# Altium schematic sheet ver061_SignalAnalog.SchDoc
size A3; SheetNumber: 5; SheetTotal: 6
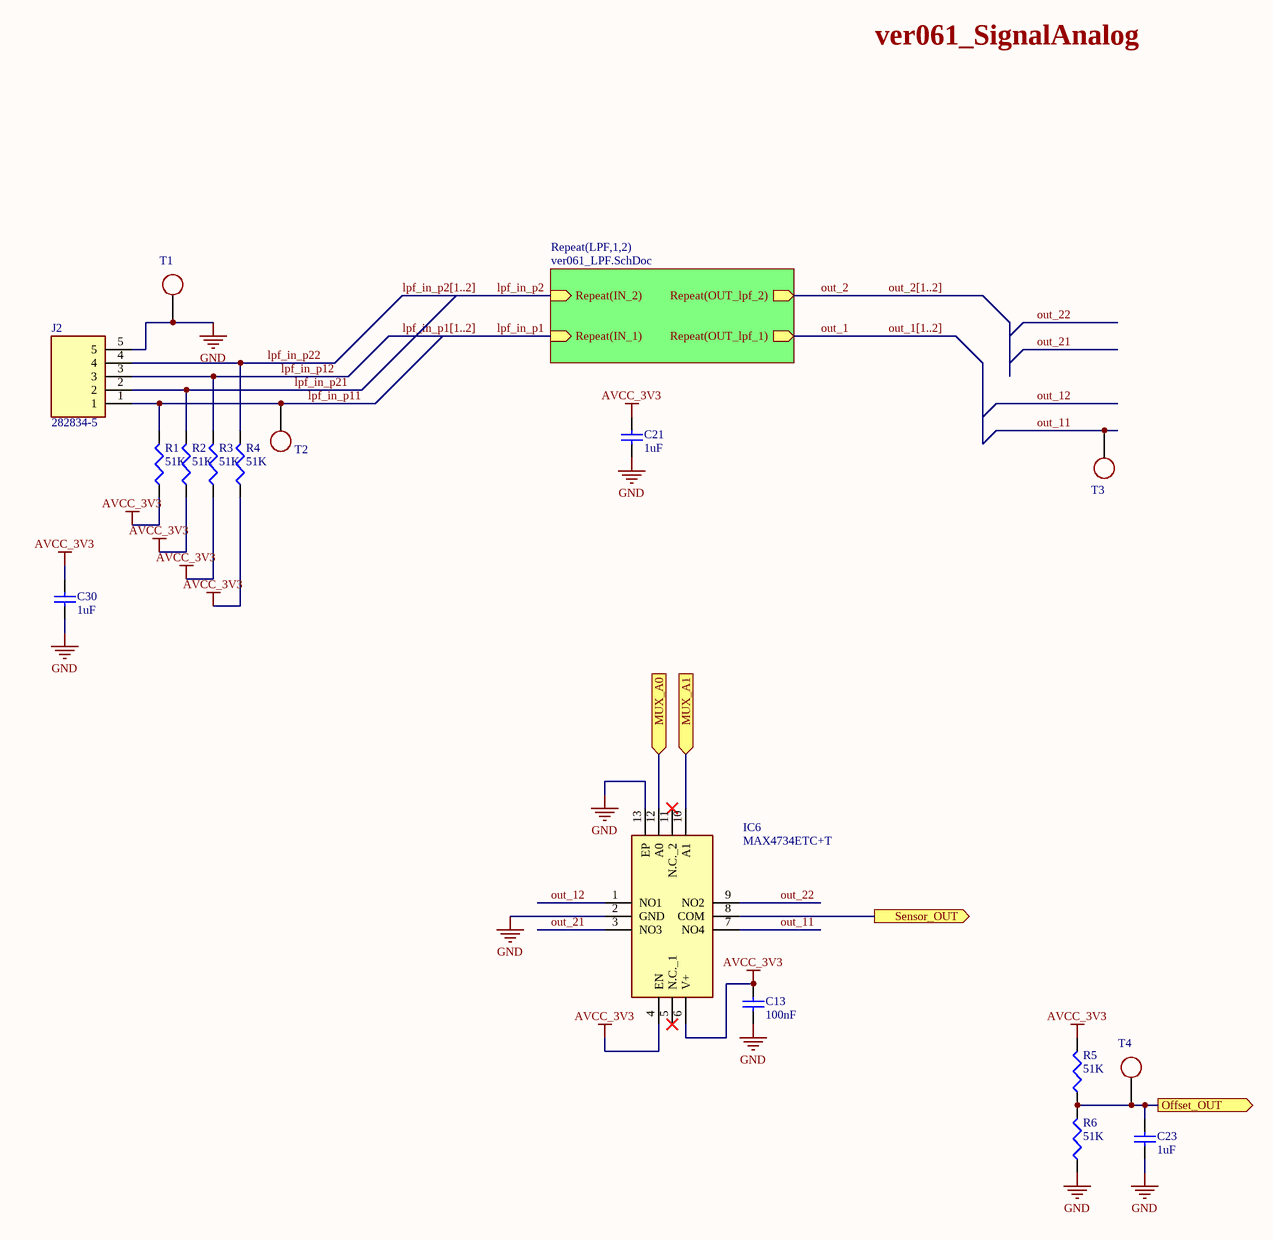
[diagram p0: ver061_SignalAnalog.SchDoc]

## Parts
C13  value 100nF  [1608[0603]]  (hidden comment: Cap Semi)
C21  value 1uF  [1608[0603]]  (hidden comment: Cap Semi)
C23  value 1uF  [0402]  (hidden comment: Cap Semi)
C30  value 1uF  [1608[0603]]  (hidden comment: Cap Semi)
IC6  MAX4734ETC+T  [QFN50P300X300X80-13N]
J2  282834-5  [2828345]
R1  value 51K  [RESC1608X55N]  (hidden comment: Res3)
R2  value 51K  [RESC1608X55N]  (hidden comment: Res3)
R3  value 51K  [RESC1608X55N]  (hidden comment: Res3)
R4  value 51K  [RESC1608X55N]  (hidden comment: Res3)
R5  value 51K  [RESC1005X35N]  (hidden comment: Res3)
R6  value 51K  [RESC1005X35N]  (hidden comment: Res3)
T1  TP_SMT  [TP_SMT_Round_0.6x0.6]  (value not drawn)
T2  TP_SMT  [TP_SMT_Round_0.6x0.6]  (value not drawn)
T3  TP_SMT  [TP_SMT_Round_0.6x0.6]  (value not drawn)
T4  TP_SMT  [TP_SMT_Round_0.6x0.6]  (value not drawn)

## Sub-sheets
Repeat(LPF,1,2) = ver061_LPF.SchDoc: Repeat(IN_1) (in), Repeat(IN_2) (in), Repeat(OUT_lpf_2) (out), Repeat(OUT_lpf_1) (out)

## Ports
MUX_A0 (in), MUX_A1 (in), Offset_OUT (out), Sensor_OUT (out)

## Nets
AVCC_3V3: C13.2 C21.2 C30.2 IC6.4(EN) IC6.6(V+) R1.1 R2.1 R3.1 R4.1 R5.2
GND: C13.1 C21.1 C23.1 C30.1 IC6.2(GND) IC6.13(EP) J2.5 R6.1 T1.1
lpf_in_p1: sheet Repeat(LPF,1,2)/Repeat(IN_1)
lpf_in_p2: sheet Repeat(LPF,1,2)/Repeat(IN_2)
lpf_in_p11: J2.1 R1.2 T2.1
lpf_in_p12: J2.3 R3.2
lpf_in_p21: J2.2 R2.2
lpf_in_p22: J2.4 R4.2
MUX_A0: IC6.12(A0) ; port MUX_A0
MUX_A1: IC6.10(A1) ; port MUX_A1
Offset_OUT: C23.2 R5.1 R6.2 T4.1 ; port Offset_OUT
out_1: sheet Repeat(LPF,1,2)/Repeat(OUT_lpf_1)
out_2: sheet Repeat(LPF,1,2)/Repeat(OUT_lpf_2)
out_11: IC6.7(NO4) T3.1
out_12: IC6.1(NO1)
out_21: IC6.3(NO3)
out_22: IC6.9(NO2)
Sensor_OUT: IC6.8(COM) ; port Sensor_OUT

Not connected (* = marked no-connect by the designer): IC6 5(N.C._1)* 11(N.C._2)*

## Buses and harness runs
bus lpf_in_p1[1..2]
bus lpf_in_p2[1..2]
bus out_1[1..2]
bus out_2[1..2]

## Notes on the sheet
- ver061_SignalAnalog

## Library data of the parts
C13 C21 C23 C30 = Cap Semi: Capacitor (Semiconductor SIM Model); Published: 8-Jun-2000; LatestRevisionDate: 29-May-2009; LatestRevisionNote: IPC-7351 Footprint Added.; PackageReference: C1206; Publisher: Altium Limited; PackageDescription: Chip Capacitor
IC6 = MAX4734ETC+T: Integrated Circuit; Manufacturer_Name: Analog Devices; Datasheet Link: https://datasheets.maximintegrated.com/en/ds/MAX4734.pdf; Height: 0.8mm; Manufacturer_Part_Number: MAX4734ETC+T; Mouser Part Number: 700-MAX4734ETCT; Mouser Price/Stock: https://www.mouser.co.uk/ProductDetail/Analog-Devices-Maxim-Integrated/MAX4734ETC%2bT?qs=LHmEVA8xxfYMT3DtZOqchA%3D%3D
J2 = 282834-5: Connector; Manufacturer_Name: TE Connectivity; Datasheet Link: https://www.te.com/commerce/DocumentDelivery/DDEController?Action=showdoc&DocId=Customer+Drawing%7F282834%7FC1%7Fpdf%7FEnglish%7FENG_CD_282834_C1.pdf%7F282834-5; Height: 10.3mm; Manufacturer_Part_Number: 282834-5; Mouser Part Number: 571-282834-5; Mouser Price/Stock: https://www.mouser.co.uk/ProductDetail/TE-Connectivity/282834-5?qs=A%252Bip%252BNCYi6PY1Kyrkp4b4w%3D%3D; Arrow Part Number: 282834-5; Arrow Price/Stock: https://www.arrow.com/en/products/282834-5/te-connectivity?region=nac
R1-R6 = Res3: Resistor; Published: 8-Jun-2000; LatestRevisionDate: 29-May-2009; LatestRevisionNote: IPC-7351 Footprint Added.; PackageReference: J1-0603; Publisher: Altium Limited; PackageDescription: Chip Resistor